# Altium schematic sheet 7CUN RGB V0.0.1.SchDoc
size A3
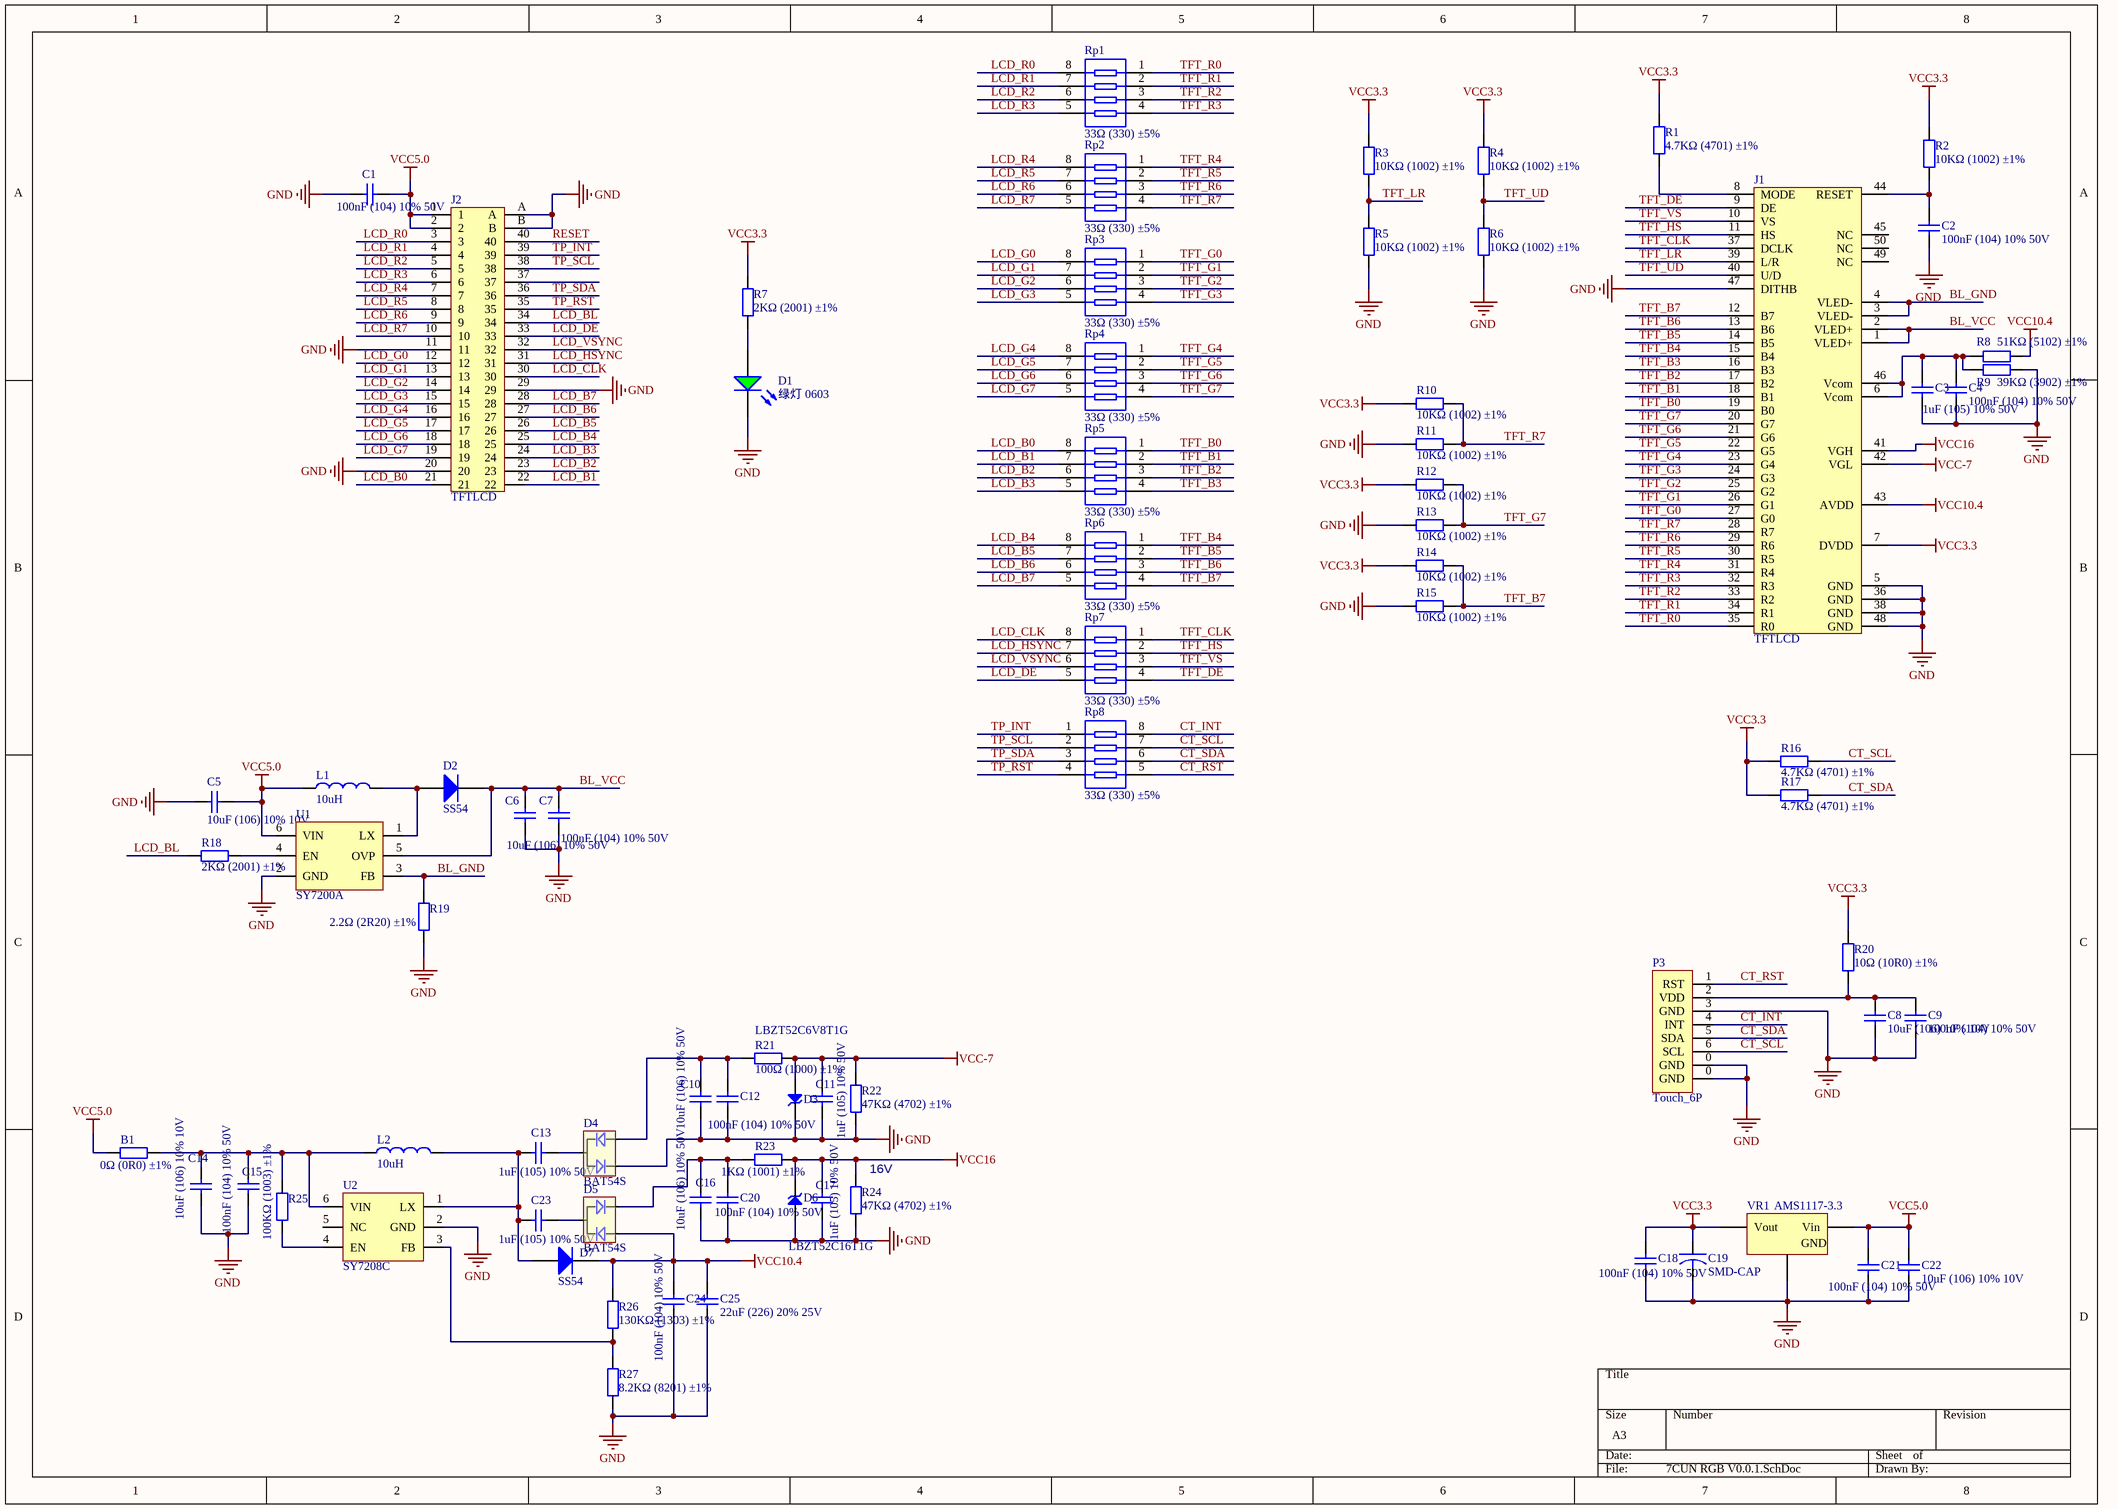
[diagram p0: 7CUN RGB V0.0.1.SchDoc]

## Parts
B1  0Ω (0R0) ±1%  [0603_R]
C1  100nF (104) 10% 50V  [0603_C]
C2  100nF (104) 10% 50V  [0603_C]
C3  1uF (105) 10% 50V  [0603_C]
C4  100nF (104) 10% 50V  [0603_C]
C5  10uF (106) 10% 10V  [0603_C]
C6  10uF (106) 10% 50V  [1206_C]
C7  100nF (104) 10% 50V  [0603_C]
C8  10uF (106) 10% 10V  [0603_C]
C9  100nF (104) 10% 50V  [0603_C]
C10  10uF (106) 10% 50V  [1206_C]
C11  1uF (105) 10% 50V  [0603_C]
C12  100nF (104) 10% 50V  [0603_C]
C13  1uF (105) 10% 50V  [0603_C]
C14  10uF (106) 10% 10V  [0603_C]
C15  100nF (104) 10% 50V  [0603_C]
C16  10uF (106) 10% 50V  [1206_C]
C17  1uF (105) 10% 50V  [0603_C]
C18  100nF (104) 10% 50V  [0603_C]
C19  SMD-CAP  [SMD-6.5mm]
C20  100nF (104) 10% 50V  [0603_C]
C21  100nF (104) 10% 50V  [0603_C]
C22  10uF (106) 10% 10V  [0603_C]
C23  1uF (105) 10% 50V  [0603_C]
C24  100nF (104) 10% 50V  [0603_C]
C25  22uF (226) 20% 25V  [0805_C]
D1  绿灯 0603  [0603_LED_S1]
D2  SS54  [SMA(DO-214AC)_S1]
D3  LBZT52C6V8T1G  [DIODE_ZMMx]
D4  BAT54S  [SOT-23]
D5  BAT54S  [SOT-23]
D6  LBZT52C16T1G  [DIODE_ZMMx]
D7  SS54  [SMA(DO-214AC)_S1]
J1  TFTLCD  [TFT3.5-50pin下接]
J2  TFTLCD  [FPC-40-0.5MM]
L1  10uH  [SOP_5020]
L2  10uH  [SOP_5020]
P3  Touch_6P  [Touch_6P]
R1  4.7KΩ (4701) ±1%  [0603_R]
R2  10KΩ (1002) ±1%  [0603_R]
R3  10KΩ (1002) ±1%  [0603_R]
R4  10KΩ (1002) ±1%  [0603_R]
R5  10KΩ (1002) ±1%  [0603_R]
R6  10KΩ (1002) ±1%  [0603_R]
R7  2KΩ (2001) ±1%  [0603_R]
R8  51KΩ (5102) ±1%  [0603_R]
R9  39KΩ (3902) ±1%  [0603_R]
R10  10KΩ (1002) ±1%  [0603_R]
R11  10KΩ (1002) ±1%  [0603_R]
R12  10KΩ (1002) ±1%  [0603_R]
R13  10KΩ (1002) ±1%  [0603_R]
R14  10KΩ (1002) ±1%  [0603_R]
R15  10KΩ (1002) ±1%  [0603_R]
R16  4.7KΩ (4701) ±1%  [0603_R]
R17  4.7KΩ (4701) ±1%  [0603_R]
R18  2KΩ (2001) ±1%  [0603_R]
R19  2.2Ω (2R20) ±1%  [0603_R]
R20  10Ω (10R0) ±1%  [0603_R]
R21  100Ω (1000) ±1%  [0603_R]
R22  47KΩ (4702) ±1%  [0603_R]
R23  1KΩ (1001) ±1%  [0603_R]
R24  47KΩ (4702) ±1%  [0603_R]
R25  100KΩ (1003) ±1%  [0603_R]
R26  130KΩ (1303) ±1%  [0603_R]
R27  8.2KΩ (8201) ±1%  [0603_R]
Rp1  33Ω (330) ±5%  [0402_Rx4]
Rp2  33Ω (330) ±5%  [0402_Rx4]
Rp3  33Ω (330) ±5%  [0402_Rx4]
Rp4  33Ω (330) ±5%  [0402_Rx4]
Rp5  33Ω (330) ±5%  [0402_Rx4]
Rp6  33Ω (330) ±5%  [0402_Rx4]
Rp7  33Ω (330) ±5%  [0402_Rx4]
Rp8  33Ω (330) ±5%  [0402_Rx4]
U1  SY7200A  [SOT23-6]
U2  SY7208C  [SOT23-6]
VR1  AMS1117-3.3  [SOT-223]

## Nets
GND: C1.2 C2.1 C3.1 C4.1 C5.2 C6.1 C7.1 C8.1 C9.1 C10.1 C11.1 C12.1 C14.1 C15.1 C16.1 C17.1 C18.1 C19.2 C20.1 C21.1 C22.1 C24.1 C25.1 D1.K D3.2 D4.2 D6.1 J1.5(GND) J1.36(GND) J1.38(GND) J1.47(DITHB) J1.48(GND) J2.11 J2.20 J2.29 J2.A J2.B P3.0(GND) P3.3(GND) R5.1 R6.1 R9.2 R11.2 R13.2 R15.2 R19.1 R22.1 R24.1 R27.1 U1.2(GND) U2.2(GND) VR1.1(GND)
VCC3.3: C18.2 C19.1 J1.7(DVDD) R1.2 R2.2 R3.2 R4.2 R7.2 R10.2 R12.2 R14.2 R16.1 R17.1 R20.2 VR1.2(Vout)
VCC5.0: B1.1 C1.1 C5.1 C21.2 C22.2 J2.1 J2.2 L1.1 U1.6(VIN) VR1.3(Vin)
VCC10.4: C24.2 C25.2 D5.1 D7.2(K) J1.43(AVDD) R8.2 R26.2
VCC16: C17.2 D6.2 J1.41(VGH) R23.2 R24.2
VCC-7: C11.2 D3.1 J1.42(VGL) R21.2 R22.2
BL_GND: J1.3(VLED-) J1.4(VLED-) R19.2 U1.3(FB)
BL_VCC: C6.2 C7.2 D2.2(K) J1.1(VLED+) J1.2(VLED+) U1.5(OVP)
CT_INT: P3.4(INT) Rp8.8
CT_RST: P3.1(RST) Rp8.5
CT_SCL: P3.6(SCL) R16.2 Rp8.7
CT_SDA: P3.5(SDA) R17.2 Rp8.6
LCD_B0: J2.21 Rp5.8
LCD_B1: J2.22 Rp5.7
LCD_B2: J2.23 Rp5.6
LCD_B3: J2.24 Rp5.5
LCD_B4: J2.25 Rp6.8
LCD_B5: J2.26 Rp6.7
LCD_B6: J2.27 Rp6.6
LCD_B7: J2.28 Rp6.5
LCD_BL: J2.34 R18.1
LCD_CLK: J2.30 Rp7.8
LCD_DE: J2.33 Rp7.5
LCD_G0: J2.12 Rp3.8
LCD_G1: J2.13 Rp3.7
LCD_G2: J2.14 Rp3.6
LCD_G3: J2.15 Rp3.5
LCD_G4: J2.16 Rp4.8
LCD_G5: J2.17 Rp4.7
LCD_G6: J2.18 Rp4.6
LCD_G7: J2.19 Rp4.5
LCD_HSYNC: J2.31 Rp7.7
LCD_R0: J2.3 Rp1.8
LCD_R1: J2.4 Rp1.7
LCD_R2: J2.5 Rp1.6
LCD_R3: J2.6 Rp1.5
LCD_R4: J2.7 Rp2.8
LCD_R5: J2.8 Rp2.7
LCD_R6: J2.9 Rp2.6
LCD_R7: J2.10 Rp2.5
LCD_VSYNC: J2.32 Rp7.6
RESET: J2.40
TFT_B0: J1.19(B0) Rp5.1
TFT_B1: J1.18(B1) Rp5.2
TFT_B2: J1.17(B2) Rp5.3
TFT_B3: J1.16(B3) Rp5.4
TFT_B4: J1.15(B4) Rp6.1
TFT_B5: J1.14(B5) Rp6.2
TFT_B6: J1.13(B6) Rp6.3
TFT_B7: J1.12(B7) R14.1 R15.1 Rp6.4
TFT_CLK: J1.37(DCLK) Rp7.1
TFT_DE: J1.9(DE) Rp7.4
TFT_G0: J1.27(G0) Rp3.1
TFT_G1: J1.26(G1) Rp3.2
TFT_G2: J1.25(G2) Rp3.3
TFT_G3: J1.24(G3) Rp3.4
TFT_G4: J1.23(G4) Rp4.1
TFT_G5: J1.22(G5) Rp4.2
TFT_G6: J1.21(G6) Rp4.3
TFT_G7: J1.20(G7) R12.1 R13.1 Rp4.4
TFT_HS: J1.11(HS) Rp7.2
TFT_LR: J1.39(L/R) R3.1 R5.2
TFT_R0: J1.35(R0) Rp1.1
TFT_R1: J1.34(R1) Rp1.2
TFT_R2: J1.33(R2) Rp1.3
TFT_R3: J1.32(R3) Rp1.4
TFT_R4: J1.31(R4) Rp2.1
TFT_R5: J1.30(R5) Rp2.2
TFT_R6: J1.29(R6) Rp2.3
TFT_R7: J1.28(R7) R10.1 R11.1 Rp2.4
TFT_UD: J1.40(U/D) R4.1 R6.2
TFT_VS: J1.10(VS) Rp7.3
TP_INT: J2.39 Rp8.1
TP_RST: J2.35 Rp8.4
TP_SCL: J2.38 Rp8.2
TP_SDA: J2.36 Rp8.3
NetB1_2: B1.2 C14.2 C15.2 L2.1 R25.2 U2.6(VIN)
NetC2_2: C2.2 J1.44(RESET) R2.1
NetC3_2: C3.2 C4.2 J1.6(Vcom) J1.46(Vcom) R8.1 R9.1
NetC8_2: C8.2 C9.2 P3.2(VDD) R20.1
NetC10_2: C10.2 C12.2 D4.1 R21.1
NetC13_1: C13.1 C23.1 D7.1(A) L2.2 U2.1(LX)
NetC13_2: C13.2 D4.3
NetC16_2: C16.2 C20.2 D5.2 R23.1
NetC23_2: C23.2 D5.3
NetD1_A: D1.A R7.1
NetD2_1: D2.1(A) L1.2 U1.1(LX)
NetJ1_8: J1.8(MODE) R1.1
NetR18_2: R18.2 U1.4(EN)
NetR25_1: R25.1 U2.4(EN)
NetR26_1: R26.1 R27.2 U2.3(FB)

Not connected (* = marked no-connect by the designer): J1 45(NC) 49(NC) 50(NC); J2 37; U2 5(NC)

## Notes on the sheet
- (near R24) 16V

## Library data of the parts
B1 = 0603 0Ω (0R0) 1%: 贴片电阻; ComponentLink1Description: 供应商链接; ComponentLink1URL: http://www.szlcsc.com/product/details_21903.html; Package: 0603; Supplier: LC; SuppliersPartNumber: C21189
C1 C2 C4 C7 C9 C12 C15 C18 C20 C21 C24 = 0603 100nF (104) 10% 50V: 贴片电容; ComponentLink1Description: 供应商链接; ComponentLink1URL: http://www.szlcsc.com/product/details_15331.html; Package: 0603; Supplier: LC; SuppliersPartNumber: C14663
C3 C11 C13 C17 C23 = 0603 1uF (105) 10% 50V: 贴片电容; ComponentLink1Description: 供应商链接; ComponentLink1URL: http://www.szlcsc.com/product/details_16531.html; Package: 0603; Supplier: LC; SuppliersPartNumber: C15849
C5 C8 C14 C22 = 0603 10uF (106) 10% 10V: 贴片电容; ComponentLink1Description: 供应商链接; ComponentLink1URL: http://www.szlcsc.com/product/details_20411.html; Package: 0603; Supplier: LC; SuppliersPartNumber: C19702
C6 C10 C16 = 1206 10uF (106) 10% 50V: 贴片电容; ComponentLink1Description: 供应商链接; ComponentLink1URL: http://www.szlcsc.com/product/details_14236.html; Package: 1206; Supplier: LC; SuppliersPartNumber: C13585
C25 = 0805 22uF (226) 20% 25V: 贴片电容; ComponentLink1Description: 供应商链接; ComponentLink1URL: http://www.szlcsc.com/product/details_46786.html; Package: 0805; Supplier: LC; SuppliersPartNumber: C45783
D1 = 0603 绿灯: 发光二极管; ComponentLink1Description: 供应商链接; ComponentLink1URL: http://www.szlcsc.com/product/details_73152.html; Package: 0603; Supplier: LC; SuppliersPartNumber: C72043
D2 D7 = SMA(DO-214AC) SS54: 二极管; ComponentLink1Description: 供应商链接; ComponentLink1URL: http://www.szlcsc.com/product/details_23178.html; Package: SMA(DO-214AC); Supplier: LC; SuppliersPartNumber: C22452
D3 D6 = ZMM3V6
D4 D5 = BAT54S: 双肖特基二极管
J1 = AT070TN92: 7' TFTLCD
J2 = FPC-40: FPC-40P-0.5mm
L1 L2 = L-SOP(5020)
R1 R16 R17 = 0603 4.7KΩ (4701) 1%: 贴片电阻; ComponentLink1Description: 供应商链接; ComponentLink1URL: http://www.szlcsc.com/product/details_23889.html; Package: 0603; Supplier: LC; SuppliersPartNumber: C23162
R2-R6 R10-R15 = 0603 10KΩ (1002) 1%: 贴片电阻; ComponentLink1Description: 供应商链接; ComponentLink1URL: http://www.szlcsc.com/product/details_26547.html; Package: 0603; Supplier: LC; SuppliersPartNumber: C25804
R7 R18 = 0603 2KΩ (2001) 1%: 贴片电阻; ComponentLink1Description: 供应商链接; ComponentLink1URL: http://www.szlcsc.com/product/details_23702.html; Package: 0603; Supplier: LC; SuppliersPartNumber: C22975
R8 = 0603 51KΩ (5102) 1%: 贴片电阻; ComponentLink1Description: 供应商链接; ComponentLink1URL: http://www.szlcsc.com/product/details_23923.html; Package: 0603; Supplier: LC; SuppliersPartNumber: C23196
R9 = 0603 39KΩ (3902) 1%: 贴片电阻; ComponentLink1Description: 供应商链接; ComponentLink1URL: http://www.szlcsc.com/product/details_23880.html; Package: 0603; Supplier: LC; SuppliersPartNumber: C23153
R19 = 0603 2.2Ω (2R20) 1%: 贴片电阻; ComponentLink1Description: 供应商链接; ComponentLink1URL: http://www.szlcsc.com/product/details_23666.html; Package: 0603; Supplier: LC; SuppliersPartNumber: C22939
R20 = 0603 10Ω (10R0) 1%: 贴片电阻; ComponentLink1Description: 供应商链接; ComponentLink1URL: http://www.szlcsc.com/product/details_23586.html; Package: 0603; Supplier: LC; SuppliersPartNumber: C22859
R21 = 0603 100Ω (1000) 1%: 贴片电阻; ComponentLink1Description: 供应商链接; ComponentLink1URL: http://www.szlcsc.com/product/details_23502.html; Package: 0603; Supplier: LC; SuppliersPartNumber: C22775
R22 R24 = 0603 47KΩ (4702) 1%: 贴片电阻; ComponentLink1Description: 供应商链接; ComponentLink1URL: http://www.szlcsc.com/product/details_26562.html; Package: 0603; Supplier: LC; SuppliersPartNumber: C25819
R23 = 0603 1KΩ (1001) 1%: 贴片电阻; ComponentLink1Description: 供应商链接; ComponentLink1URL: http://www.szlcsc.com/product/details_21904.html; Package: 0603; Supplier: LC; SuppliersPartNumber: C21190
R25 = 0603 100KΩ (1003) 1%: 贴片电阻; ComponentLink1Description: 供应商链接; ComponentLink1URL: http://www.szlcsc.com/product/details_26546.html; Package: 0603; Supplier: LC; SuppliersPartNumber: C25803
R26 = 0603 130KΩ (1303) 1%: 贴片电阻; ComponentLink1Description: 供应商链接; ComponentLink1URL: http://www.szlcsc.com/product/details_23522.html; Package: 0603; Supplier: LC; SuppliersPartNumber: C22795
R27 = 0603 8.2KΩ (8201) 1%: 贴片电阻; ComponentLink1Description: 供应商链接; ComponentLink1URL: http://www.szlcsc.com/product/details_26724.html; Package: 0603; Supplier: LC; SuppliersPartNumber: C25981
Rp1-Rp8 = 0402*4 33Ω (330) 5%: 贴片排阻; ComponentLink1Description: 供应商链接; ComponentLink1URL: http://www.szlcsc.com/product/details_26244.html; Package: 0402*4; Supplier: LC; SuppliersPartNumber: C25501
VR1 = SOT-223 AMS1117-3.3: 低压差线性稳压(LDO); ComponentLink1Description: 供应商链接; ComponentLink1URL: http://www.szlcsc.com/product/details_6652.html; Package: SOT-223; Supplier: LC; SuppliersPartNumber: C6186